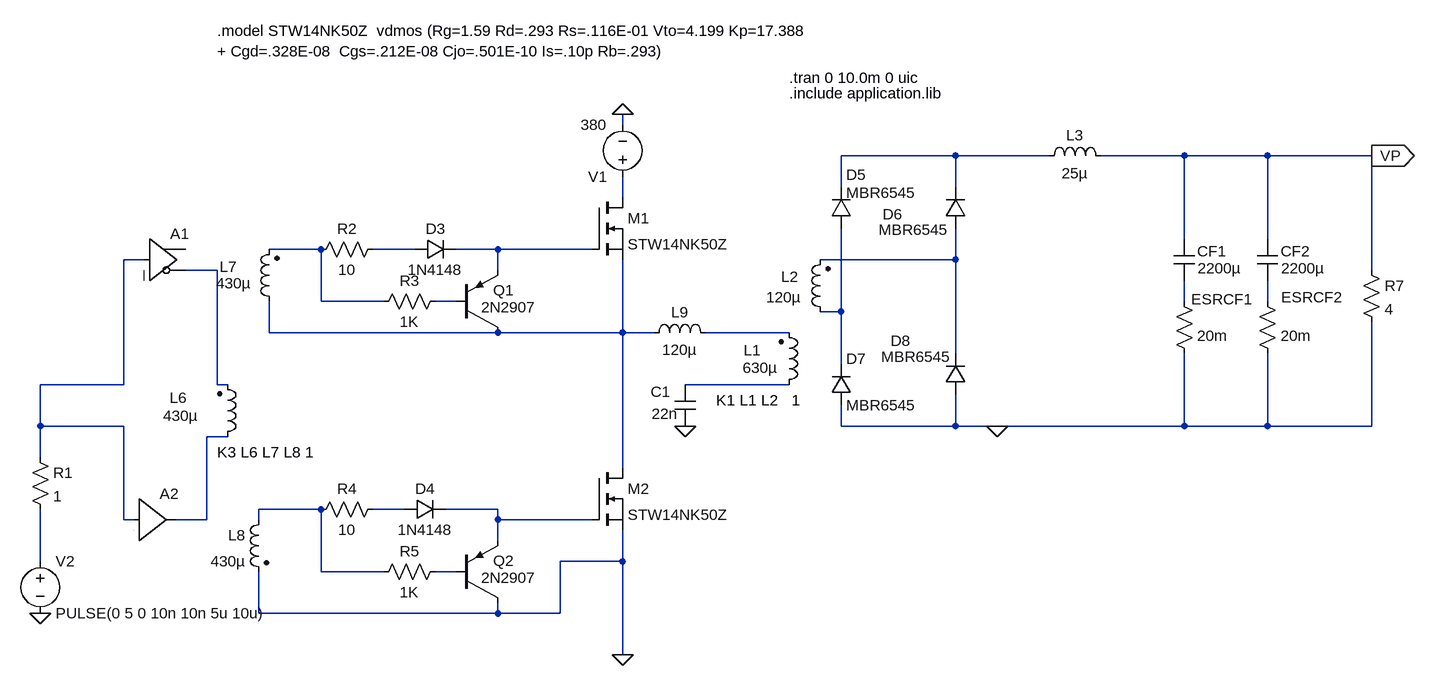
[diagram p0: schematic AN4151.asc]
AN4151.asc, the LTspice schematic file:
Version 4
SHEET 1 2292 824
WIRE 288 -144 288 -160
WIRE 800 -96 624 -96
WIRE 944 -96 800 -96
WIRE 1152 -96 1024 -96
WIRE 1280 -96 1152 -96
WIRE 1440 -96 1280 -96
WIRE 624 -48 624 -96
WIRE 800 -48 800 -96
WIRE 288 -32 288 -64
WIRE 1152 32 1152 -96
WIRE 1280 32 1280 -96
WIRE -176 48 -256 48
WIRE -32 48 -96 48
WIRE 96 48 32 48
WIRE 240 48 96 48
WIRE -448 64 -480 64
WIRE 800 64 800 16
WIRE 800 64 592 64
WIRE -336 80 -384 80
WIRE 96 80 96 48
WIRE 1440 80 1440 -96
WIRE -176 128 -176 48
WIRE -80 128 -176 128
WIRE 32 128 0 128
WIRE 1152 128 1152 96
WIRE 1280 128 1280 96
WIRE 624 144 624 16
WIRE 624 144 592 144
WIRE -256 176 -256 128
WIRE 96 176 -256 176
WIRE 288 176 288 64
WIRE 288 176 96 176
WIRE 336 176 288 176
WIRE 544 176 416 176
WIRE 800 208 800 64
WIRE 624 224 624 144
WIRE -480 256 -480 64
WIRE -480 256 -608 256
WIRE -336 256 -336 80
WIRE -320 256 -336 256
WIRE 544 256 384 256
WIRE -608 320 -608 256
WIRE -480 320 -608 320
WIRE 624 320 624 288
WIRE 800 320 800 272
WIRE 800 320 624 320
WIRE 864 320 800 320
WIRE 1152 320 1152 208
WIRE 1152 320 864 320
WIRE 1280 320 1280 208
WIRE 1280 320 1152 320
WIRE 1440 320 1440 160
WIRE 1440 320 1280 320
WIRE -320 336 -352 336
WIRE -608 368 -608 320
WIRE 288 384 288 176
WIRE -176 448 -272 448
WIRE -48 448 -96 448
WIRE 96 448 16 448
WIRE -480 464 -480 320
WIRE -464 464 -480 464
WIRE -352 464 -352 336
WIRE -352 464 -400 464
WIRE -272 464 -272 448
WIRE 96 464 96 448
WIRE 240 464 96 464
WIRE 96 496 96 464
WIRE -608 528 -608 448
WIRE 288 528 288 480
WIRE 288 528 192 528
WIRE -176 544 -176 448
WIRE -80 544 -176 544
WIRE 32 544 0 544
WIRE -272 608 -272 544
WIRE 96 608 96 592
WIRE 96 608 -272 608
WIRE 192 608 192 528
WIRE 192 608 96 608
WIRE 288 672 288 528
FLAG 288 -160 0
FLAG 1440 -96 VP
IOPIN 1440 -96 Out
FLAG 288 672 0
FLAG 384 320 0
FLAG 864 320 0
FLAG -608 608 0
SYMBOL voltage 288 -48 R180
WINDOW 123 0 0 Left 0
WINDOW 39 0 0 Left 0
SYMATTR InstName V1
SYMATTR Value 380
SYMBOL diode -32 64 R270
WINDOW 0 32 32 VTop 0
WINDOW 3 0 32 VBottom 0
SYMATTR InstName D3
SYMATTR Value 1N4148
SYMBOL res -80 32 R90
WINDOW 0 0 56 VBottom 0
WINDOW 3 32 56 VTop 0
SYMATTR InstName R2
SYMATTR Value 10
SYMBOL res 16 112 R90
WINDOW 0 0 56 VBottom 0
WINDOW 3 32 56 VTop 0
SYMATTR InstName R3
SYMATTR Value 1K
SYMBOL pnp 32 176 M180
WINDOW 0 57 65 Left 0
WINDOW 3 38 39 Left 0
SYMATTR InstName Q1
SYMATTR Value 2N2907
SYMBOL diode -48 464 R270
WINDOW 0 32 32 VTop 0
WINDOW 3 0 32 VBottom 0
SYMATTR InstName D4
SYMATTR Value 1N4148
SYMBOL res -80 432 R90
WINDOW 0 0 56 VBottom 0
WINDOW 3 32 56 VTop 0
SYMATTR InstName R4
SYMATTR Value 10
SYMBOL res 16 528 R90
WINDOW 0 0 56 VBottom 0
WINDOW 3 32 56 VTop 0
SYMATTR InstName R5
SYMATTR Value 1K
SYMBOL pnp 32 592 M180
WINDOW 0 57 65 Left 0
WINDOW 3 38 39 Left 0
SYMATTR InstName Q2
SYMATTR Value 2N2907
SYMBOL ind2 528 272 M180
WINDOW 0 -54 69 Left 0
WINDOW 3 -55 42 Left 0
SYMATTR InstName L1
SYMATTR Value 630µ
SYMATTR Type ind
SYMATTR SpiceLine Rser=100m
SYMBOL ind2 608 160 R180
WINDOW 0 49 70 Left 0
WINDOW 3 45 38 Left 0
SYMATTR InstName L2
SYMATTR Value 120µ
SYMATTR Type ind
SYMATTR SpiceLine Rser=10m
SYMBOL cap 1136 32 R0
WINDOW 0 36 19 Left 0
WINDOW 3 37 45 Left 0
SYMATTR InstName CF1
SYMATTR Value 2200µ
SYMBOL res 1136 112 R0
WINDOW 0 27 13 Left 0
WINDOW 3 36 69 Left 0
SYMATTR InstName ESRCF1
SYMATTR Value 20m
SYMBOL diode 640 16 R180
WINDOW 0 -23 83 Left 0
WINDOW 3 -99 55 Left 0
SYMATTR InstName D5
SYMATTR Value MBR6545
SYMBOL diode 816 16 R180
WINDOW 0 97 22 Left 0
WINDOW 3 27 -2 Left 0
SYMATTR InstName D6
SYMATTR Value MBR6545
SYMBOL diode 608 288 M180
WINDOW 0 24 72 Left 0
WINDOW 3 24 0 Left 0
SYMATTR InstName D7
SYMATTR Value MBR6545
SYMBOL diode 784 272 M180
WINDOW 0 -84 83 Left 0
WINDOW 3 -98 59 Left 0
SYMATTR InstName D8
SYMATTR Value MBR6545
SYMBOL res 1424 64 R0
SYMATTR InstName R7
SYMATTR Value 4
SYMBOL ind2 -336 352 M180
WINDOW 0 -73 76 Left 0
WINDOW 3 -83 48 Left 0
SYMATTR InstName L6
SYMATTR Value 430µ
SYMATTR Type ind
SYMATTR SpiceLine Rser=100m
SYMBOL ind2 -240 144 R180
WINDOW 0 65 69 Left 0
WINDOW 3 43 44 Left 0
SYMATTR InstName L7
SYMATTR Value 430µ
SYMATTR Type ind
SYMATTR SpiceLine Rser=10m
SYMBOL ind2 -256 448 M0
SYMATTR InstName L8
SYMATTR Value 430µ
SYMATTR Type ind
SYMATTR SpiceLine Rser=10m
SYMBOL Digital\\buf1 -464 400 R0
WINDOW 3 0 0 Invisible 0
SYMATTR Value ref =1.5
SYMATTR InstName A2
SYMATTR Value2 Vhigh = 15 vlow = 0
SYMATTR SpiceLine TD=2N TRISE=10N TFALL=10N
SYMBOL ind 320 192 R270
WINDOW 0 32 56 VTop 0
WINDOW 3 5 56 VBottom 0
SYMATTR InstName L9
SYMATTR Value 120µ
SYMBOL cap 368 256 R0
WINDOW 0 -37 11 Left 0
WINDOW 3 -35 45 Left 0
SYMATTR InstName C1
SYMATTR Value 22n
SYMBOL cap 1264 32 R0
WINDOW 0 36 19 Left 0
WINDOW 3 37 45 Left 0
SYMATTR InstName CF2
SYMATTR Value 2200µ
SYMBOL res 1264 112 R0
WINDOW 0 37 10 Left 0
WINDOW 3 36 69 Left 0
SYMATTR InstName ESRCF2
SYMATTR Value 20m
SYMBOL voltage -608 512 R0
WINDOW 123 0 0 Left 0
WINDOW 39 0 0 Left 0
SYMATTR InstName V2
SYMATTR Value PULSE(0 5 0 10n 10n 5u 10u)
SYMBOL res -624 352 R0
SYMATTR InstName R1
SYMATTR Value 1
SYMBOL Digital\\buf -448 0 R0
WINDOW 3 0 0 Invisible 0
SYMATTR Value ref =1.5
SYMATTR InstName A1
SYMATTR Value2 Vhigh = 15 vlow = 0
SYMATTR SpiceLine TD=2N TRISE=10N TFALL=10N
SYMBOL nmos 240 -32 R0
SYMATTR InstName M1
SYMATTR Value STW14NK50Z
SYMBOL nmos 240 384 R0
SYMATTR InstName M2
SYMATTR Value STW14NK50Z
SYMBOL ind 928 -80 R270
WINDOW 0 32 56 VTop 0
WINDOW 3 5 56 VBottom 0
SYMATTR InstName L3
SYMATTR Value 25µ
SYMATTR SpiceLine Rser=100m
TEXT 432 280 Left 0 !K1 L1 L2   1
TEXT -336 360 Left 0 !K3 L6 L7 L8 1
TEXT 544 -192 Left 0 !.include application.lib
TEXT 544 -216 Left 0 !.tran 0 10.0m 0 uic
TEXT -336 -288 Left 0 !.model STW14NK50Z  vdmos (Rg=1.59 Rd=.293 Rs=.116E-01 Vto=4.199 Kp=17.388\n+ Cgd=.328E-08  Cgs=.212E-08 Cjo=.501E-10 Is=.10p Rb=.293)

The netlist it stands for:
* AN4151.asc
V1 N002 0 380
D3 N004 N005 1N4148
R2 N004 N003 10
R3 N009 N003 1K
Q1 N013 N009 N005 0 2N2907
D4 N018 N019 1N4148
R4 N018 N017 10
R5 N021 N017 1K
Q2 0 N021 N019 0 2N2907
L1 N015 N014 630µ Rser=100m
L2 N012 N007 120µ Rser=10m
CF1 VP N010 2200µ
R§ESRCF1 N010 0 20m
D5 N012 N001 MBR6545
D6 N007 N001 MBR6545
D7 0 N012 MBR6545
D8 0 N007 MBR6545
R7 VP 0 4
L6 N016 N008 430µ Rser=100m
L7 N013 N003 430µ Rser=10m
L8 N017 0 430µ Rser=10m
A2 N006 0 0 0 0 0 N016 0 BUF ref =1.5 Vhigh = 15 vlow = 0 TD=2N TRISE=10N TFALL=10N
L9 N013 N014 120µ
C1 N015 0 22n
CF2 VP N011 2200µ
R§ESRCF2 N011 0 20m
V2 N020 0 PULSE(0 5 0 10n 10n 5u 10u)
R1 N006 N020 1
A1 N006 0 0 0 0 N008 0 0 BUF ref =1.5 Vhigh = 15 vlow = 0 TD=2N TRISE=10N TFALL=10N
M1 N002 N005 N013 N013 STW14NK50Z
M2 N013 N019 0 0 STW14NK50Z
L3 N001 VP 25µ Rser=100m
.model D D
.lib standard.dio
.model NPN NPN
.model PNP PNP
.lib standard.bjt
.model NMOS NMOS
.model PMOS PMOS
.lib standard.mos
K1 L1 L2   1
K3 L6 L7 L8 1
.include application.lib
.tran 0 10.0m 0 uic
.model STW14NK50Z  vdmos (Rg=1.59 Rd=.293 Rs=.116E-01 Vto=4.199 Kp=17.388
+ Cgd=.328E-08  Cgs=.212E-08 Cjo=.501E-10 Is=.10p Rb=.293)
.backanno
.end